# Altium schematic sheet leo_MOTORS.SchDoc
size 381 x 250 mm; SheetNumber: 3; SheetTotal: 5
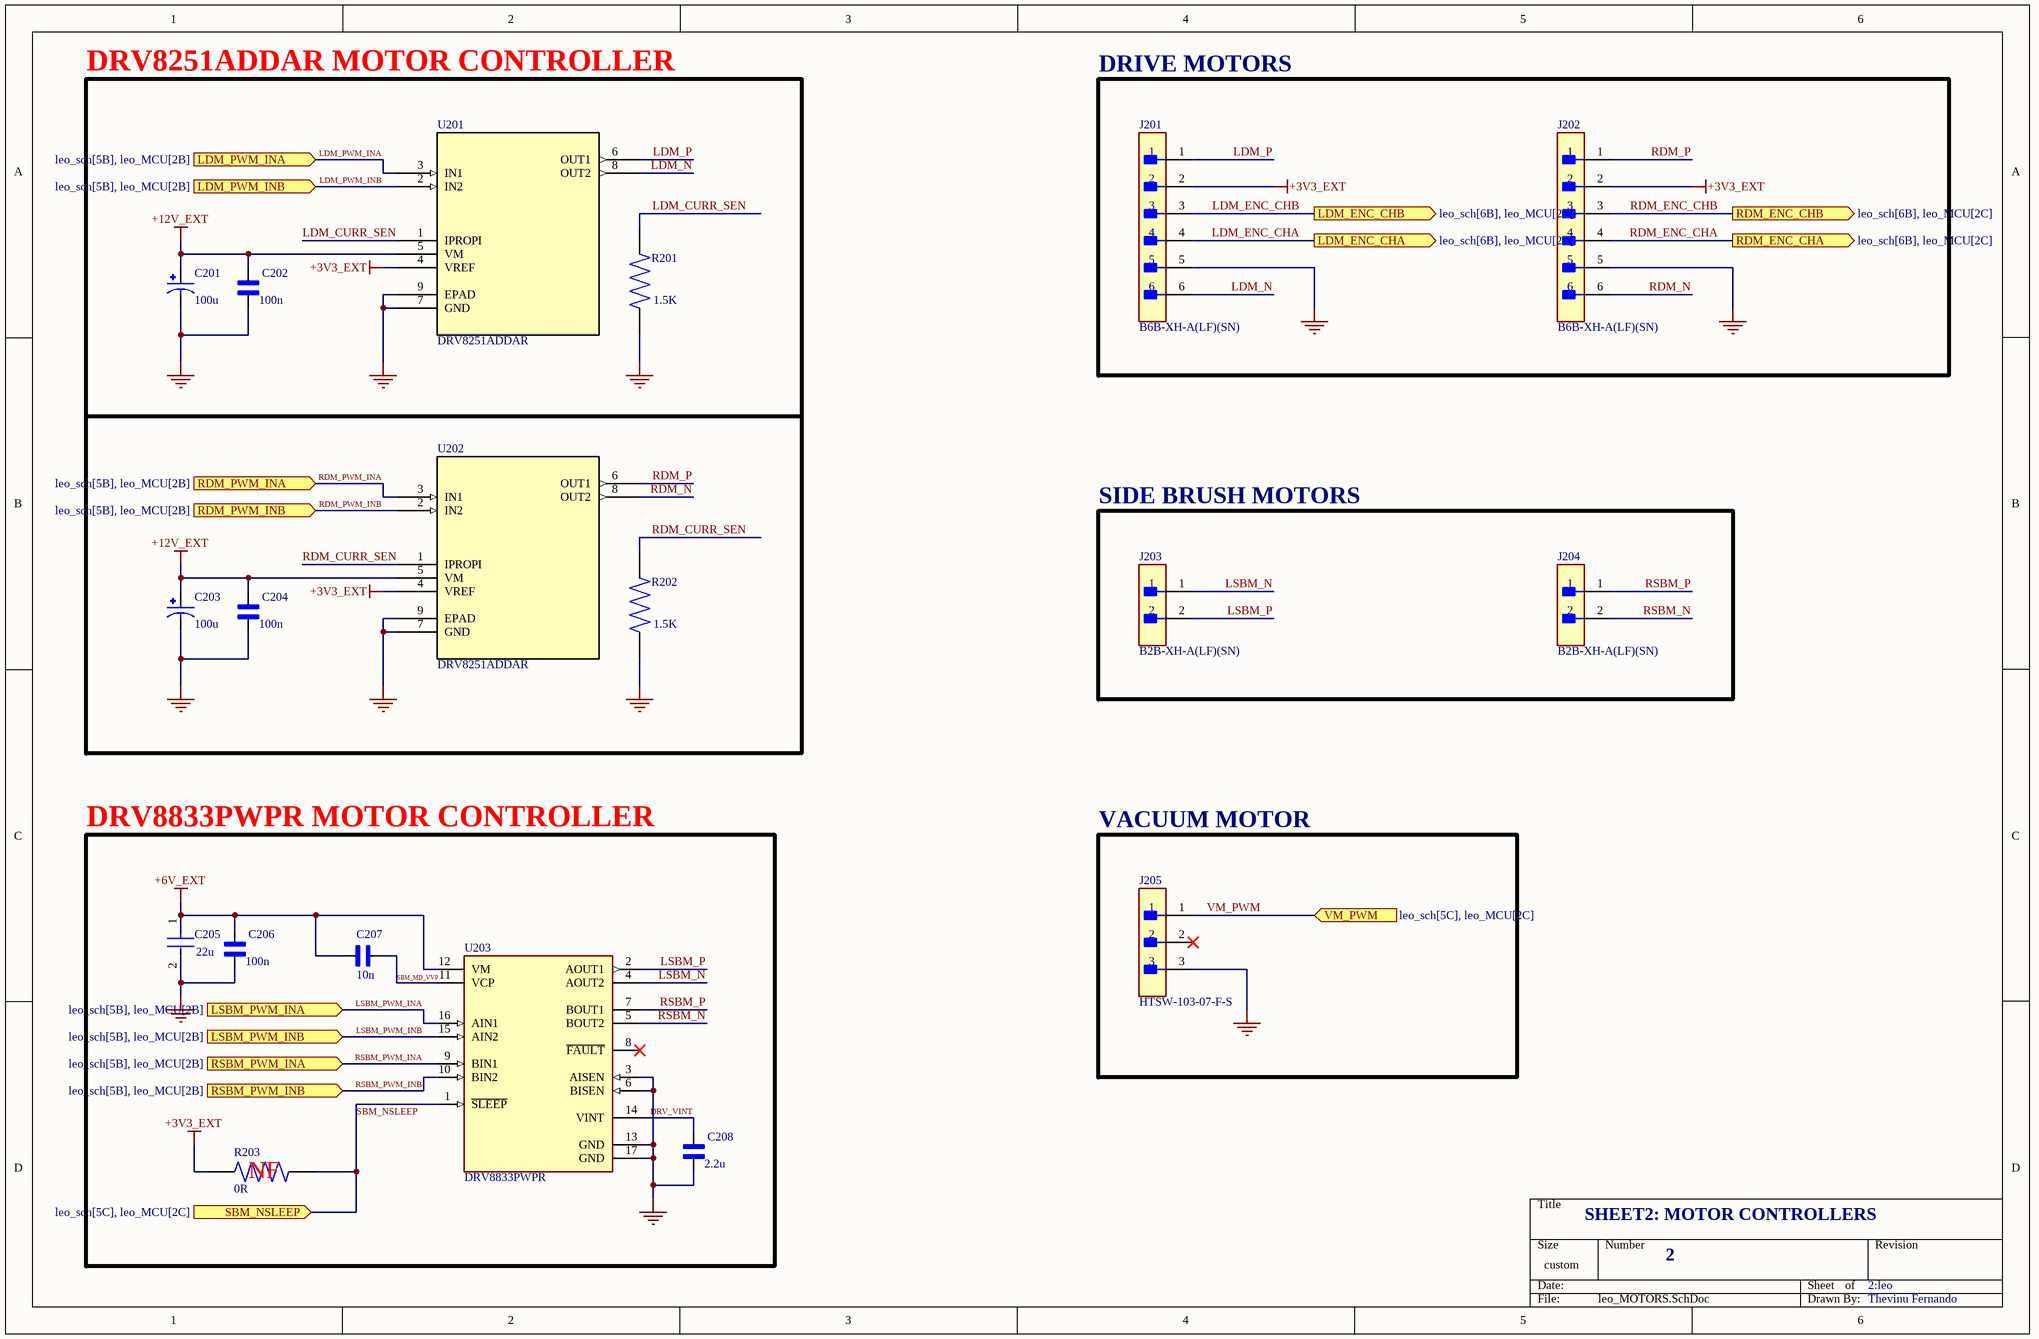
[diagram p0: leo_MOTORS.SchDoc]

## Parts
C201  100u  [CAP_EEHZA1E101XP]
C202  100n  [CAP_0603]
C203  100u  [CAP_EEHZA1E101XP]
C204  100n  [CAP_0603]
C205  22u  [CAP_1206]
C206  100n  [CAP_0402]
C207  10n  [CAP_0402]
C208  2.2u  [CAP_0603]
J201  B6B-XH-A(LF)(SN)  [FP-B6B-XH-A_LF_SN-MFG]
J202  B6B-XH-A(LF)(SN)  [FP-B6B-XH-A_LF_SN-MFG]
J203  B2B-XH-A(LF)(SN)  [FP-B2B-XH-A_LF_SN-MFG]
J204  B2B-XH-A(LF)(SN)  [FP-B2B-XH-A_LF_SN-MFG]
J205  HTSW-103-07-F-S  [FP-HTSW-103-07-F-S-MFG]
R201  1.5K  [RES_0603]
R202  1.5K  [RES_0603]
R203  0R  [RES_0402]
U201  DRV8251ADDAR  [SOIC8_DDA_TEX]
U202  DRV8251ADDAR  [SOIC8_DDA_TEX]
U203  DRV8833PWPR  [FP-PWP0016C-IPC_B]

## Blocks framed on the sheet
DRV8251ADDAR MOTOR CONTROLLER: C201-C204 R201 R202 U201 U202
DRIVE MOTORS: J201 J202
SIDE BRUSH MOTORS: J203 J204
DRV8833PWPR MOTOR CONTROLLER: C205-C208 R203 U203
VACUUM MOTOR: J205

## Ports
LDM_ENC_CHA (out, see leo_sch[6B], leo_MCU[2C]), LDM_ENC_CHB (out, see leo_sch[6B], leo_MCU[2C]), LDM_PWM_INA (in, see leo_sch[5B], leo_MCU[2B]), LDM_PWM_INB (in, see leo_sch[5B], leo_MCU[2B]), LSBM_PWM_INA (in, see leo_sch[5B], leo_MCU[2B]), LSBM_PWM_INB (in, see leo_sch[5B], leo_MCU[2B]), RDM_ENC_CHA (out, see leo_sch[6B], leo_MCU[2C]), RDM_ENC_CHB (out, see leo_sch[6B], leo_MCU[2C]), RDM_PWM_INA (in, see leo_sch[5B], leo_MCU[2B]), RDM_PWM_INB (in, see leo_sch[5B], leo_MCU[2B]), RSBM_PWM_INA (in, see leo_sch[5B], leo_MCU[2B]), RSBM_PWM_INB (in, see leo_sch[5B], leo_MCU[2B]), SBM_NSLEEP (in, see leo_sch[5C], leo_MCU[2C]), VM_PWM (in, see leo_sch[5C], leo_MCU[2C])

## Nets
+3V3_EXT: J201.2 J202.2 R203.2 U201.4(VREF) U202.4(VREF)
+6V_EXT: C205.1 C206.2 C207.2 U203.12(VM)
+12V_EXT: C201.1 C202.2 C203.1 C204.2 U201.5(VM) U202.5(VM)
GND: C201.2 C202.1 C203.2 C204.1 C205.2 C206.1 C208.1 J201.5 J202.5 J205.3 R201.1 R202.1 U201.7(GND) U201.9(EPAD) U202.7(GND) U202.9(EPAD) U203.3(AISEN) U203.6(BISEN) U203.13(GND) U203.17(GND)
DRV_VINT: C208.2 U203.14(VINT)
LDM_CURR_SEN: R201.2 U201.1(IPROPI)
LDM_ENC_CHA: J201.4 ; port LDM_ENC_CHA
LDM_ENC_CHB: J201.3 ; port LDM_ENC_CHB
LDM_N: J201.6 U201.8(OUT2)
LDM_P: J201.1 U201.6(OUT1)
LDM_PWM_INA: U201.3(IN1) ; port LDM_PWM_INA
LDM_PWM_INB: U201.2(IN2) ; port LDM_PWM_INB
LSBM_N: J203.1 U203.4(AOUT2)
LSBM_P: J203.2 U203.2(AOUT1)
LSBM_PWM_INA: U203.16(AIN1) ; port LSBM_PWM_INA
LSBM_PWM_INB: U203.15(AIN2) ; port LSBM_PWM_INB
RDM_CURR_SEN: R202.2 U202.1(IPROPI)
RDM_ENC_CHA: J202.4 ; port RDM_ENC_CHA
RDM_ENC_CHB: J202.3 ; port RDM_ENC_CHB
RDM_N: J202.6 U202.8(OUT2)
RDM_P: J202.1 U202.6(OUT1)
RDM_PWM_INA: U202.3(IN1) ; port RDM_PWM_INA
RDM_PWM_INB: U202.2(IN2) ; port RDM_PWM_INB
RSBM_N: J204.2 U203.5(BOUT2)
RSBM_P: J204.1 U203.7(BOUT1)
RSBM_PWM_INA: U203.9(BIN1) ; port RSBM_PWM_INA
RSBM_PWM_INB: U203.10(BIN2) ; port RSBM_PWM_INB
SBM_MD_VVP: C207.1 U203.11(VCP)
SBM_NSLEEP: R203.1 U203.1(~{SLEEP}) ; port SBM_NSLEEP
VM_PWM: J205.1 ; port VM_PWM

Not connected (* = marked no-connect by the designer): J205 2*; U203 8(~{FAULT})*

## Notes on the sheet
- (near R203) NF
- SHEET2: MOTOR CONTROLLERS
- 2
- 2:leo
- Thevinu Fernando

## Library data of the parts
C201 C203 = EEHZA1E101XP: 100F 25V Aluminum - Polymer Capacitors Radial, Can - SMD 30mOhm 10000 Hrs @ 105C; MF: Panasonic; Package: RADIAL-2 Panasonic; Price: None; Check_prices: https://www.snapeda.com/parts/EEHZA1E101XP/Panasonic/view-part/?ref=eda; Value: *; SnapEDA_Link: https://www.snapeda.com/parts/EEHZA1E101XP/Panasonic/view-part/?ref=snap; MP: EEHZA1E101XP; Availability: In Stock; Purchase-URL: https://pricing.snapeda.com/search/part/EEHZA1E101XP/?ref=eda
C202 C204 C208 = CAP_0603: Ceramic Capacitor X5R 0603 (1608 Metric); MF: Samsung Electro-Mechanics; MP: CL10A475KO8NNNC; SnapEDA_Link: https://www.snapeda.com/parts/CL10A475KO8NNNC/Samsung/view-part/?ref=snap; Package: SMD-2 Samsung; Value: *; Check_prices: https://www.snapeda.com/parts/CL10A475KO8NNNC/Samsung/view-part/?ref=eda
C205 = CAP_1206: Ceramic Capacitor, Multilayer, Ceramic, 25V, 10% +Tol, 10% -Tol, X5R, 15% TC, 22uF, Surface Mount, 1206; Part Number: CL31A226KAHNNNE; Manufacturer: Samsung; Symbol Hash: fb88589c83559698c54462c48d907c3ddae810bd717f4f20b193cecb944ab7ab; Verification Version: 0.0.0.3; Capacitance: 22µF; Mouser Part Number: 187-CL31A226KAHNNNE; Temperature Coefficient: 15%; Temperature Range High: +85°C; Digikey Description: CAP CER 22UF 25V X5R 1206; Digikey Part Number: 1276-3047-1-ND; Tolerance: 10%; ComponentLink2URL: https://product.samsungsem.com/mlcc/CL31A226KAHNNN.do; ComponentLink2Description: Datasheet; Voltage Rating: 25V; Lead Free: Yes; Height: 1.8mm; Temperature Characteristic: X5R; Automotive: No; Package: CL31H-0.2; Temperature Range Low: -55°C; Capacitance: 22uF; RoHS: TRUE; Material: Ceramic; Ipc Land Pattern Name: CAPC320160X160; ComponentLink1Description: Upverter; Supplier 2: Mouser; Supplier 1: Digi-Key; ComponentLink1URL: https://upverter.com/part/id/4e7a76ad8fe2f2e1/; Supplier Part Number 2: 187-CL31A226KAHNNNE; Supplier Part Number 1: 1276-3047-1-ND; Value: 22uF; helpURL: https://upverter.com/part/id/4e7a76ad8fe2f2e1/; Temperature: -55°C to +85°C; RoHS: Compliant; Dielectric: X5R; HelpURL: https://product.samsungsem.com/mlcc/CL31A226KAHNNN.do; Max Operating Temperature: 85°C; Voltage Rating (DC): 25V; ComponentLink2Description: Datasheet URL; Min Operating Temperature: -55°C; Case/Package: 1206
C206 C207 = CAP_0402: Ceramic Capacitor X7R 0402 (1005 Metric); MF: Samsung; MP: CL05B104KO5NNNC; SnapEDA_Link: https://www.snapeda.com/parts/CL05B104KO5NNNC/Samsung/view-part/?ref=snap; Package: SMD-2 Samsung; Value: *; Check_prices: https://www.snapeda.com/parts/CL05B104KO5NNNC/Samsung/view-part/?ref=eda
J201 J202 = B6B-XH-A(LF)(SN): CONN HEADER VERT 6POS 2.5MM
J203 J204 = B2B-XH-A(LF)(SN): CONN HEADER VERT 2POS 2.5MM; Current Rating: 3A; Voltage Rating: 250V; Number of Contacts: 2; Contact Resistance: 20mR; Wire/Cable Gauge: 22AWG; Insulation Resistance: 1GR; Connector Type: Male Pin; Packaging: Bulk; Contact Material: Brass; Lead Free: Lead Free; Orientation: Straight; Contact Plating: Tin; Max Current Rating: 3A; Termination: Solder; Fastening Type: Detent; Depth: 5.75mm; Housing Material: Polyamide; REACH SVHC: No SVHC; Series: XH; Voltage Rating (AC): 250V; Number of Positions: 2; Color: Natural; Contact Type: Male Pin; Max Voltage Rating (DC): 250V; Pitch: 2.5mm; Lead Pitch: 2.5mm; Mount: Through Hole; Max Operating Temperature: 85°C; Length: 7.4mm; Max Voltage Rating (AC): 250V; Min Operating Temperature: -25°C; Number of Rows: 1; Housing Color: White
J205 = 3P_MHEADER: CONN HEADER VERT 3POS 2.54MM; Number of Contacts: 3; Max Voltage Rating (AC): 550V; Max Current Rating: 7.6A; Gender: Male; Contact Finish - Mating: GOLD; Number of Rows: 1; Housing Material: Polymer; Insulation Color: Natural; Termination: Solder; Contact Mating Length: 0.23inch; Packaging: Bulk; Contact Shape: Square; Flammability Rating: UL94 V-0; Contact Plating: Gold; Contact Type: Male Pin; Fastening Type: Pull; RoHS Compliant: Yes; Connector Type: Header; Min Operating Temperature: -55°C; Insulation Material: Polymer; Series: HTSW; Length: 7.62mm; Orientation: Straight; Pitch: 2.54mm; REACH SVHC: No SVHC; Mount: Through Hole; Color: Natural; Contact Material: Bronze; Max Operating Temperature: 125°C; Number of Positions: 3; Depth: 2.48mm; Radiation Hardening: No; Housing Color: Natural
R201 R202 = RES_0603: 0603 Thin Film Resistor AEC-Q200; MP: ERA3VEB1501V; Package: None; Value: *; Price: None; Availability: Unavailable
R203 = RES_0402: Chip Resistor 0402 (1005 Metric) Automotive AEC-Q200 Thick Film; MF: Panasonic; MP: ERJ-2RKF1002X; Package: 1005-2 Panasonic; Price: None; Check_prices: https://www.snapeda.com/parts/ERJ-2RKF1002X/Panasonic%20Electronic%20Components/view-part/78636/?ref=eda; Value: *; SnapEDA_Link: https://www.snapeda.com/parts/ERJ-2RKF1002X/Panasonic%20Electronic%20Components/view-part/78636/?ref=snap; Availability: In Stock
U201 U202 = DRV8251ADDAR: 50-V, 4.1-A H-bridge motor driver with integrated current regulation & current-sense feedback 8-SO PowerPAD -40 to 150; Manufacturer_Name: Texas Instruments; Copyright: Copyright (C) 2026 Ultra Librarian. All rights reserved.; Manufacturer_Part_Number: DRV8251ADDAR; RefDes: RefDes; Type: Type
U203 = DRV8833PWPR: IC MOTOR DRIVER PAR 16HTSSOP; Supply Current: 3mA; Max Output Current: 2A; Interface: PWM; Output Current: 1.5A; Max Supply Voltage: 10.8V; Fault Protection: Over Temperature; Number of Outputs: 2; Min Supply Voltage: 2.7V; Nominal Supply Current: 3mA; Series: DRV8833; Min Operating Temperature: -40°C; Package Quantity: 2000; Packaging: Tape and Reel; Case/Package: HTSSOP; Output Current per Channel: 1.5A; RoHS Compliant: Yes; RMS Current (Irms): 1.5A; Max Operating Temperature: 85°C; Technology: NMOS; Number of Pins: 16; Radiation Hardening: No; Lead Free: Lead Free; REACH SVHC: No SVHC